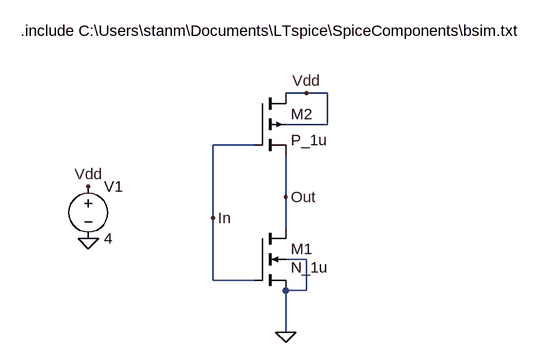
[diagram p0: schematic Inv.asc]
Inv.asc, the LTspice schematic file:
Version 4.1
SHEET 1 880 680
WIRE 176 -48 144 -48
WIRE 208 -48 176 -48
WIRE 208 0 208 -48
WIRE 208 0 144 0
WIRE 96 32 32 32
WIRE 144 112 144 48
WIRE 32 144 32 32
WIRE 144 160 144 112
WIRE 176 208 144 208
WIRE 32 240 32 144
WIRE 96 240 32 240
WIRE 176 256 176 208
WIRE 176 256 144 256
WIRE 144 320 144 256
FLAG 176 -48 Vdd
FLAG 144 320 0
FLAG -160 176 0
FLAG -160 96 Vdd
FLAG 32 144 In
FLAG 144 112 Out
SYMBOL nmos4 96 160 R0
WINDOW 3 56 60 Left 2
SYMATTR InstName M1
SYMATTR Value N_1u
SYMATTR Value2 l=1u w=10u
SYMBOL pmos4 96 -48 R0
SYMATTR InstName M2
SYMATTR Value P_1u
SYMATTR Value2 l=1u w=28u
SYMBOL voltage -160 80 R0
WINDOW 123 0 0 Left 0
WINDOW 39 0 0 Left 0
SYMATTR InstName V1
SYMATTR Value 4
TEXT -264 -144 Left 2 !.include C:\\Users\\stanm\\Documents\\LTspice\\SpiceComponents\\bsim.txt

The netlist it stands for:
* Inv.asc
M1 Out In 0 0 N_1u l=1u w=10u
M2 Vdd In Out Vdd P_1u l=1u w=28u
V1 Vdd 0 4
.model NMOS NMOS
.model PMOS PMOS
.lib standard.mos
.include C:\Users\stanm\Documents\LTspice\SpiceComponents\bsim.txt
.backanno
.end